# EAGLE schematic 15期_東北ドローン (EAGLE 9.7.0)
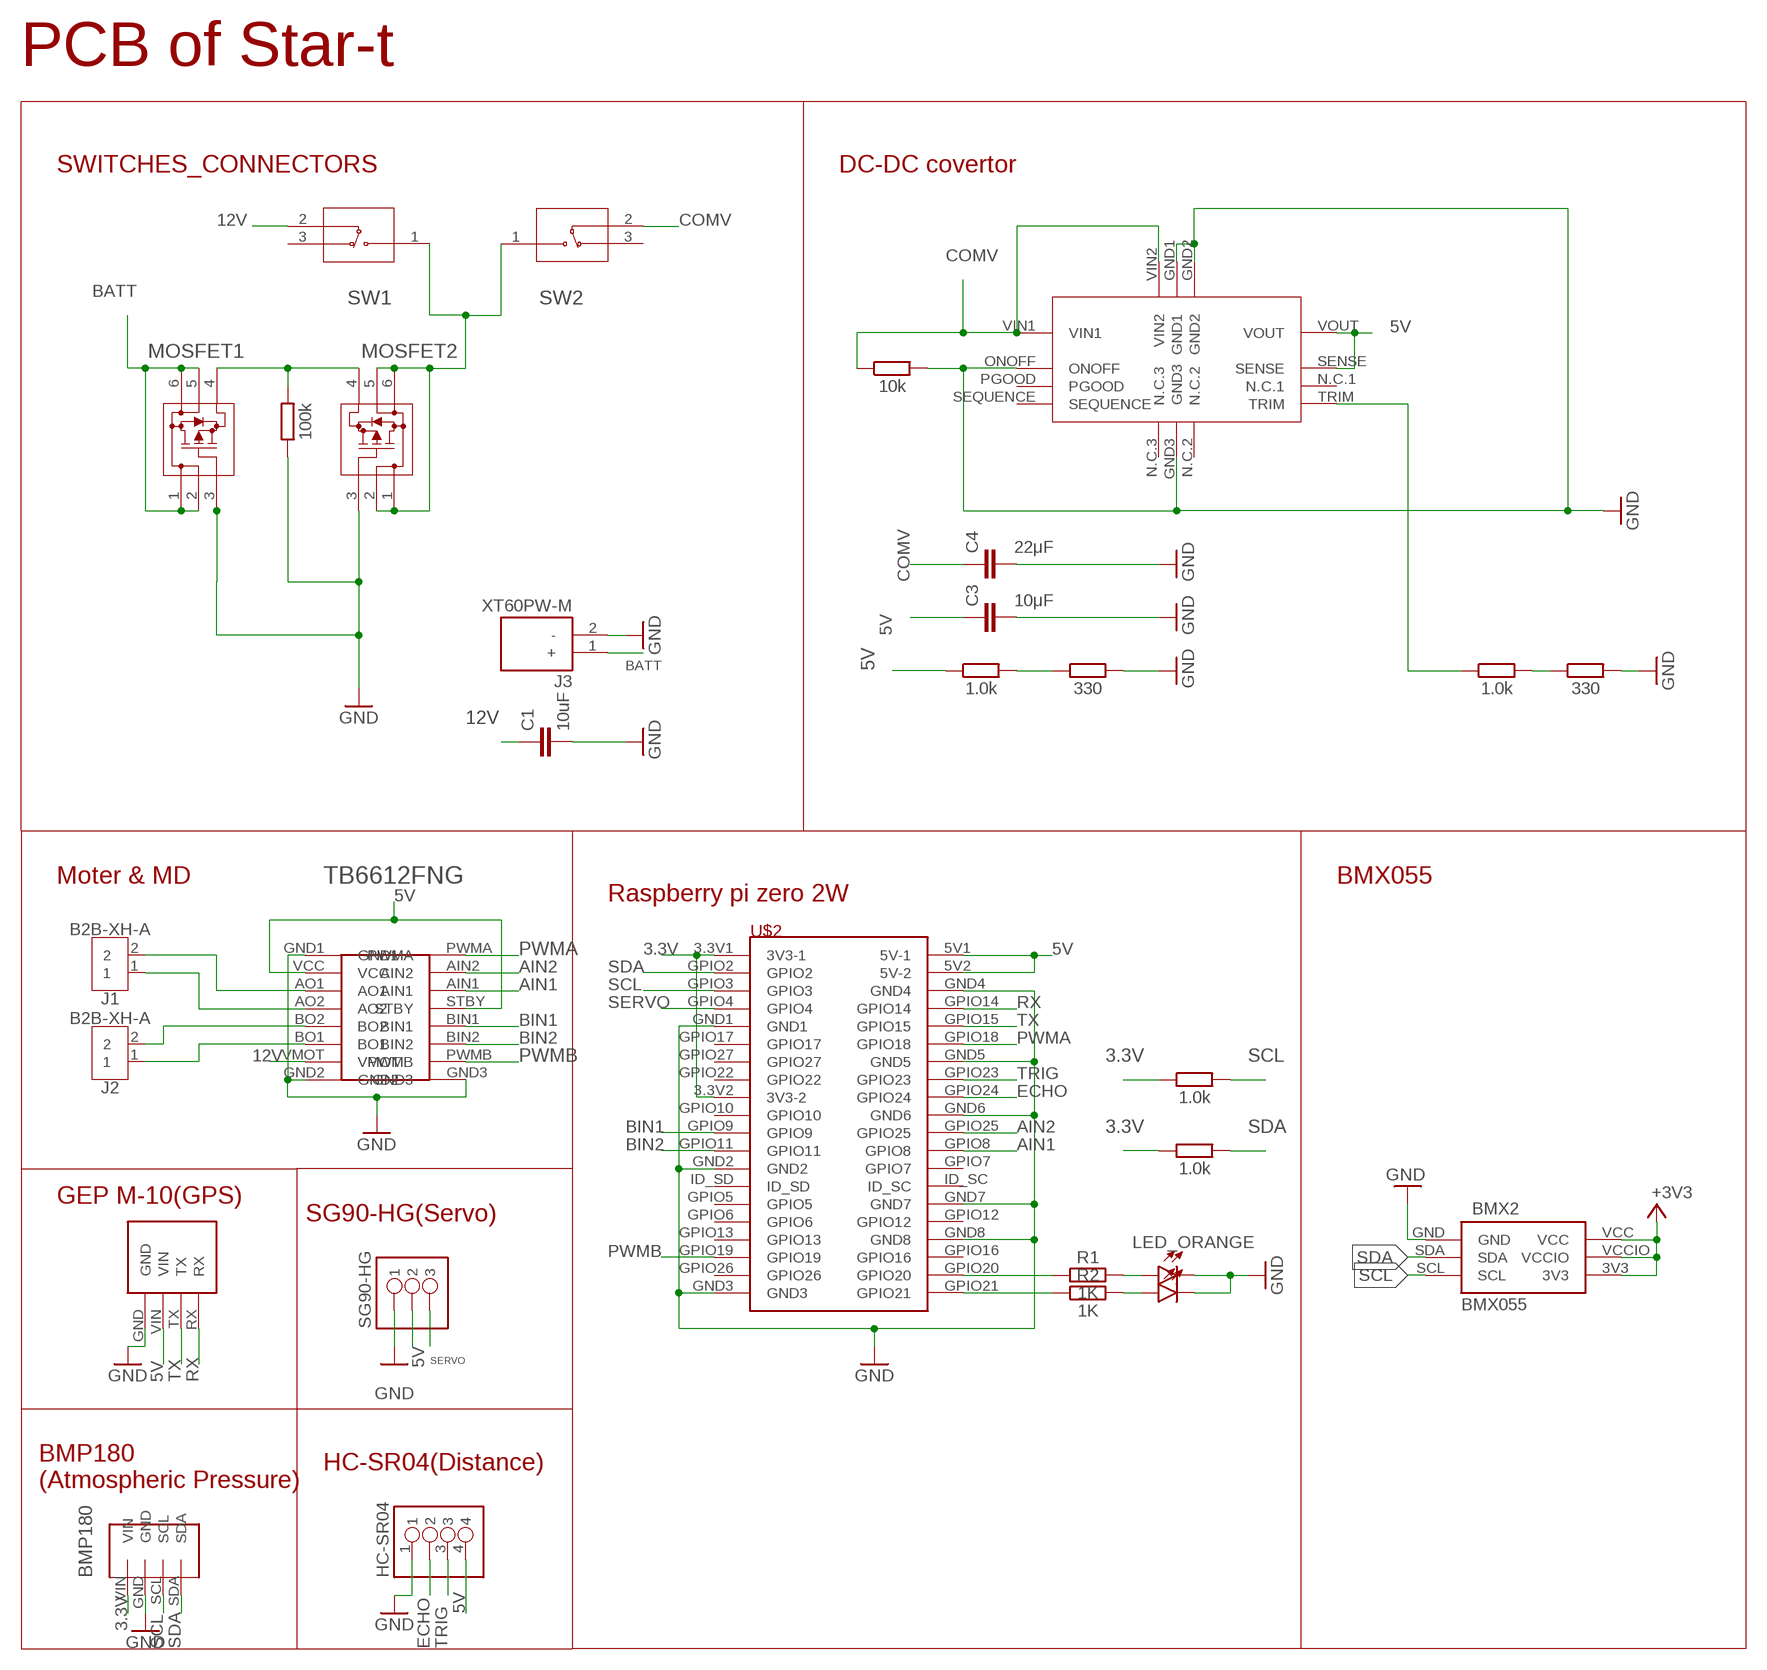
[diagram p0: schematic, sheet 1]

## Parts
BMP180  BMP180  [BMP180]
BMX2  BMX055  [BMX055]
C1  10uF  C-EUC0603  [C0603]
C3  10μF  C-EUC0603  [C0603]
C4  22μF  C-EUC0805  [C0805]
D2  LED_ORANGE  LED_RADIAL_ORANGE  [LEDRD254W60D565H860B_O]
D4  LED_ORANGE  LED_RADIAL_ORANGE  [LEDRD254W60D565H860B_O]
HC-SR04  PINHD-1X04_1X04M  [1X04]
J1  B2B-XH-A  [B2B-XH-A]
J2  B2B-XH-A  [B2B-XH-A]
J3  XT60PW-M  [AMASS_XT60PW-M]
MOSFET1  SSM6J808R,LXHFTSOP6F_TOS-L  [TSOP6F_TOS-L]
MOSFET2  SSM6J808R,LXHFTSOP6F_TOS-L  [TSOP6F_TOS-L]
R1  1K  R_AXIAL-7.2MM-PITCH  [RESAD724W46L381D178B]
R2  1K  R_AXIAL-7.2MM-PITCH  [RESAD724W46L381D178B]
R10  100k  R_AXIAL-7.2MM-PITCH  [RESAD724W46L381D178B]
R11  1.0k  R_AXIAL-7.2MM-PITCH  [RESAD724W46L381D178B]
R12  330  R_AXIAL-7.2MM-PITCH  [RESAD724W46L381D178B]
R13  1.0k  R_AXIAL-7.2MM-PITCH  [RESAD724W46L381D178B]
R14  330  R_AXIAL-7.2MM-PITCH  [RESAD724W46L381D178B]
R15  10k  R_AXIAL-7.2MM-PITCH  [RESAD724W46L381D178B]
R16  1.0k  R_AXIAL-7.2MM-PITCH  [RESAD724W46L381D178B]
R17  1.0k  R_AXIAL-7.2MM-PITCH  [RESAD724W46L381D178B]
SG90-HG  PINHD-1X03_1X03M  [1X03]
SW1  TS01CQETS01CQE_CNK  [TS01CQE_CNK]
SW2  TS01CQETS01CQE_CNK  [TS01CQE_CNK]
TB6612FNG  TB6612-FNG  [TB6612-FNG]
U$2  RASPBERYPIZEROW  [RASPBERYPIZEROW]
U$3  OKL-T/6-W12N-C  [OKL-T/6-W12N-C]
U$4  GEP-M10  [GEP-M10]

## Nets
3.3V: BMP180.VIN R16.1 R17.1 U$2.3.3V1(3V3-1) U$2.3.3V2(3V3-2)
5V: C3.1 HC-SR04.4 R11.1 SG90-HG.2 TB6612FNG.STBY TB6612FNG.VCC U$2.5V1(5V-1) U$2.5V2(5V-2) U$3.SENSE U$3.VOUT U$4.VIN
12V: C1.1 SW1.2 TB6612FNG.VMOT
+3V3: BMX2.3V3 BMX2.VCC BMX2.VCCIO
AIN1: TB6612FNG.AIN1 U$2.GPIO8
AIN2: TB6612FNG.AIN2 U$2.GPIO25
BATT: J3.1(+) MOSFET1.1 MOSFET1.2 MOSFET1.5 MOSFET1.6
BIN1: TB6612FNG.BIN1 U$2.GPIO9
BIN2: TB6612FNG.BIN2 U$2.GPIO11
COMV: C4.1 R15.1 SW2.2 U$3.VIN1 U$3.VIN2
ECHO: HC-SR04.2 U$2.GPIO24
GND: BMP180.GND BMX2.GND C1.2 C3.2 C4.2 D2.2(C) D4.2(C) HC-SR04.1 J3.2(-) R12.2 R14.2 R15.2 SG90-HG.1 TB6612FNG.GND1 TB6612FNG.GND2 TB6612FNG.GND3 U$2.GND1 U$2.GND2 U$2.GND3 U$2.GND4 U$2.GND5 U$2.GND6 U$2.GND7 U$2.GND8 U$3.GND1 U$3.GND2 U$3.GND3 U$3.ONOFF U$4.GND
GND1: MOSFET1.3 MOSFET2.3 R10.1 ; supply symbol labelled GND
N$1: R13.2 R14.1
N$2: R11.2 R12.1
N$3: J1.2 TB6612FNG.AO1
N$4: J1.1 TB6612FNG.AO2
N$5: J2.1 TB6612FNG.BO1
N$6: J2.2 TB6612FNG.BO2
N$11: R1.1 U$2.GPIO20
N$12: D2.1(A) R1.2
N$13: R2.1 U$2.GPIO21
N$14: D4.1(A) R2.2
N$15: MOSFET1.4 MOSFET2.4 R10.2
N$17: MOSFET2.1 MOSFET2.2 MOSFET2.5 MOSFET2.6 SW1.1 SW2.1
PWMA: TB6612FNG.PWMA U$2.GPIO18
PWMB: TB6612FNG.PWMB U$2.GPIO19
RX: U$2.GPIO14 U$4.RX
SCL: BMP180.SCL BMX2.SCL R16.2 U$2.GPIO3
SDA: BMP180.SDA BMX2.SDA R17.2 U$2.GPIO2
SERVO: SG90-HG.3 U$2.GPIO4
TRIG: HC-SR04.3 U$2.GPIO23
TRIM: R13.1 U$3.TRIM
TX: U$2.GPIO15 U$4.TX
Unconnected: SW1.3 SW2.3 U$2.GPIO5 U$2.GPIO6 U$2.GPIO7 U$2.GPIO10 U$2.GPIO12 U$2.GPIO13 U$2.GPIO16 U$2.GPIO17 U$2.GPIO22 U$2.GPIO26 U$2.GPIO27 U$2.ID_SC U$2.ID_SD U$3.N.C.1 U$3.N.C.2 U$3.N.C.3 U$3.PGOOD U$3.SEQUENCE

## Notes on the sheet
- PCB of Star-t
- SWITCHES_CONNECTORS | DC-DC covertor
- Moter & MD | BMX055
- Raspberry pi zero 2W
- GEP M-10(GPS)
- SG90-HG(Servo)
- HC-SR04(Distance)
- BMP180
  (Atmospheric Pressure)

## Library data of the parts
BMP180 = TB6612FNG:BMP180
BMX2 = BMX055:BMX055
C1 C3 C4 = rcl:C-EU: CAPACITOR, European symbol; SPICEPREFIX: C
D2 D4 = Tinkercad:LED_RADIAL: LED - Generic; CATEGORY: Opto-Electronic; SUB-CATEGORY: LED
HC-SR04 = Tinkercad:PINHD-1X04
J1 J2 = Connector:B2B-XH-A: XH Connector Top Entry - 2POS Details see: Datasheet <http://www.jst-mfg.com/product/pdf/eng/eXH.pdf>; CATEGORY: Header; DESCRIPTION: Connector Header Through Hole 2 position 0.098" (2.50mm); MANUFACTURER: JST Sales America Inc.; MPN: B2B-XH-A(LF)(SN); OPERATING_TEMPERATURE: -25°C ~ 85°C; PART_STATUS: ACTIVE; PITCH: 0.098" (2.50mm); ROHS_COMPLIANCE: ROHS3 Compliant; SERIES: XH; SUB_CATEGORY: Rectangular Connectors; TYPE: Header, Male Pin, Board to Cable/Wire, Through Hole
J3 = XT60PW-M:XT60PW-M: Check availability <https://pricing.snapeda.com/parts/XT60PW-M/AMASS/view-part?ref=eda>; AVAILABILITY: Not in stock; CHECK_PRICES: https://www.snapeda.com/parts/XT60PW-M/AMASS/view-part/?ref=eda; DESCRIPTION: Socket, DC supply, male, PIN: 2; MF: AMASS; MP: XT60PW-M; PACKAGE: Package; PRICE: None; SNAPEDA_LINK: https://www.snapeda.com/parts/XT60PW-M/AMASS/view-part/?ref=snap
MOSFET1 MOSFET2 = SSM6J808R:SSM6J808R,LXHF; COPYRIGHT: Copyright (C) 2024 Ultra Librarian. All rights reserved.; MANUFACTURER_PART_NUMBER: SSM6J808R,LXHF; MFR_NAME: Toshiba Electronic Devices & Storage Corp.
R1 R2 R10-R17 = Resistor:R: Resistor Fixed - Generic; CATEGORY: Resistor; SUB-CATEGORY: Fixed
SG90-HG = Tinkercad:PINHD-1X03
SW1 SW2 = TS01CQE:TS01CQE; COPYRIGHT: Copyright (C) 2024 Ultra Librarian. All rights reserved.; MANUFACTURER_PART_NUMBER: TS01CQE; MFR_NAME: C&K Components
TB6612FNG = TB6612FNG:TB6612-FNG
U$2 = RaspberyPiZeroW:RASPBERYPIZEROW
U$3 = TB6612FNG:OKL-T/6-W12N-C
U$4 = TB6612FNG:GEP-M10